# EAGLE schematic main (EAGLE 7.1.0)
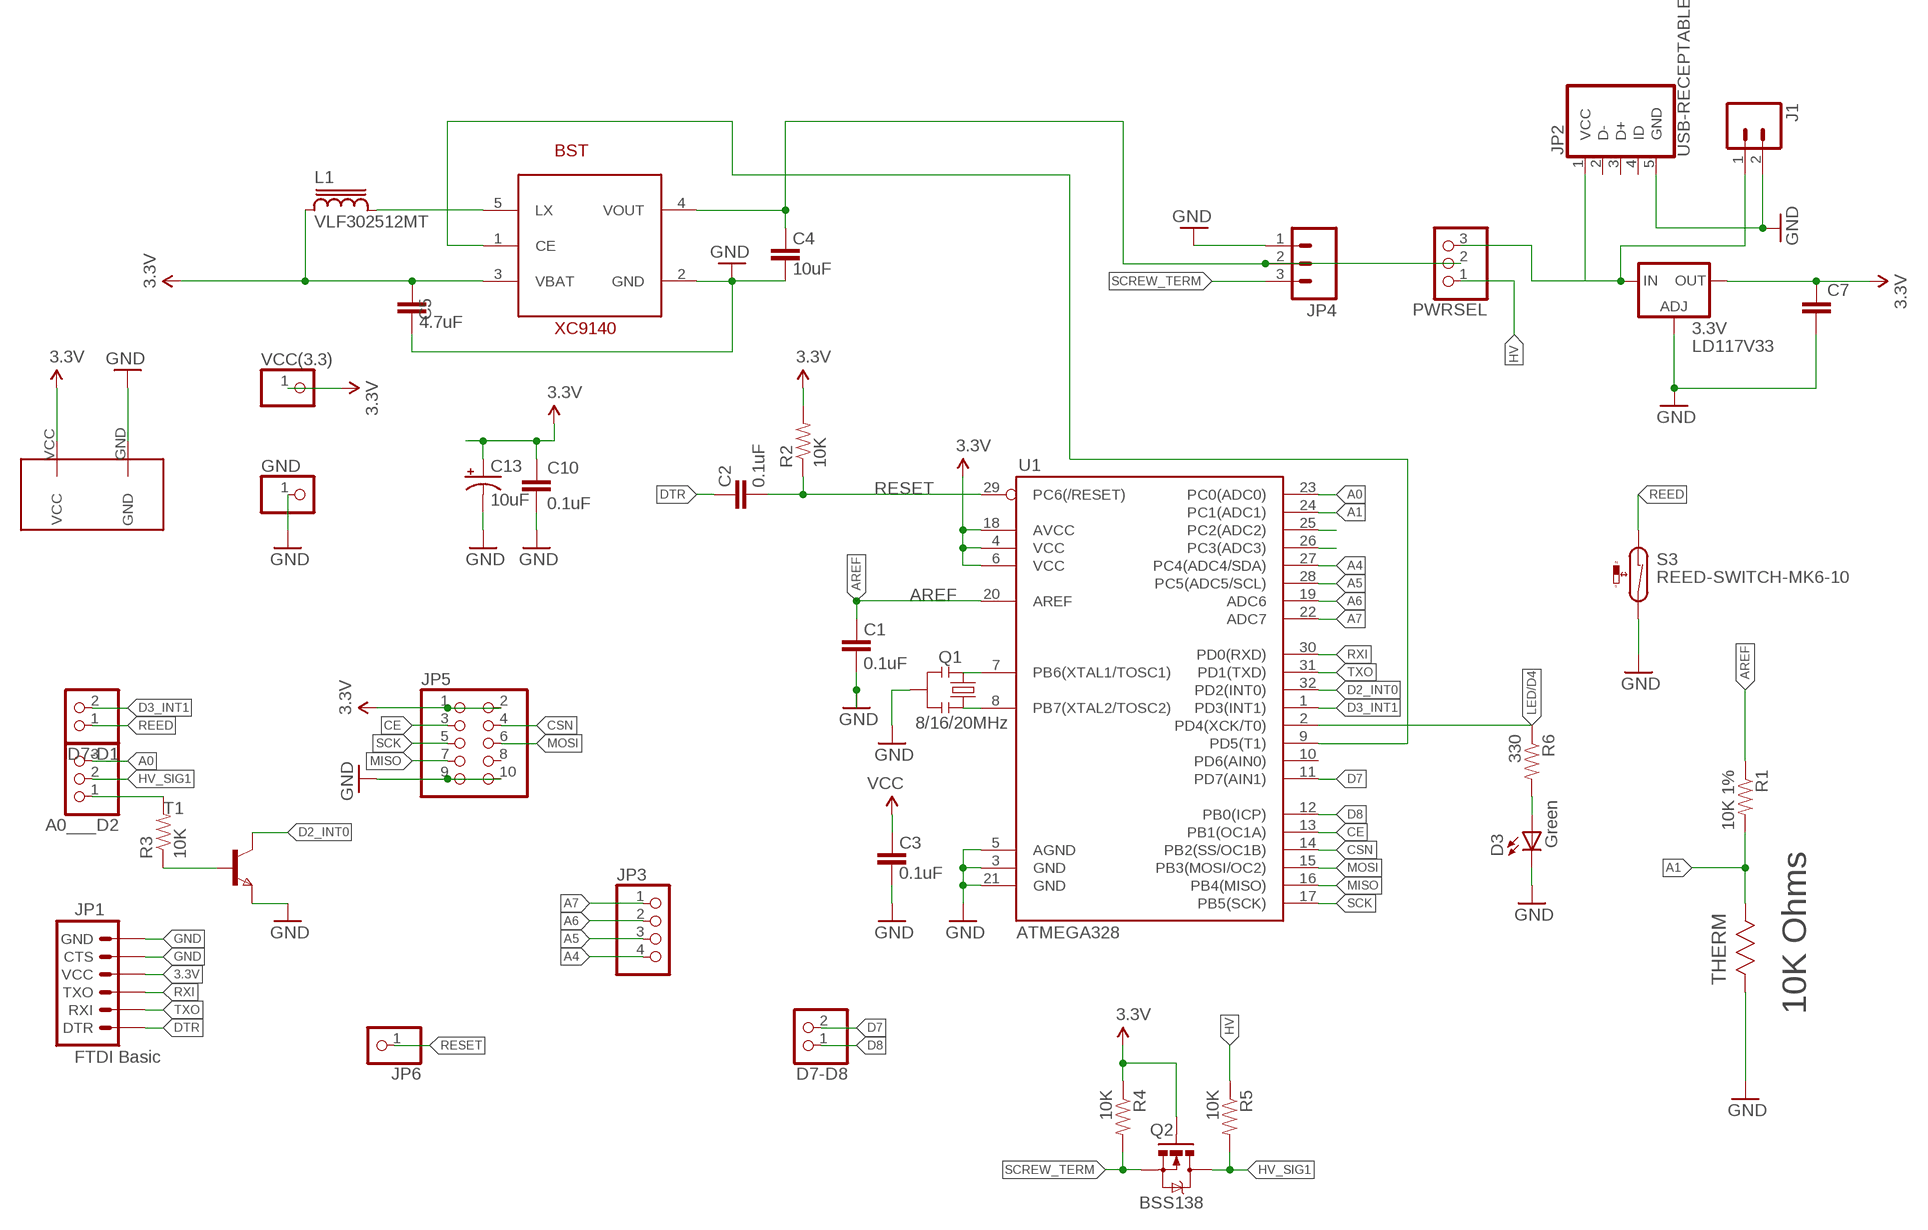
[diagram p0: schematic, sheet 1]

## Parts
3.3V  LD117V33  LD117AV  [TO220L1]
A0___D2  PINHD-1X3  [1X03]
BST  XC9140  [SOT23-5]
C1  0.1uF  CAP0603-CAP  [0603-CAP]
C2  0.1uF  CAP0603-CAP  [0603-CAP]
C3  0.1uF  CAP0603-CAP  [0603-CAP]
C4  10uF  CAP0603-CAP  [0603-CAP]
C5  4.7uF  CAP0603-CAP  [0603-CAP]
C7  C2.5/2  [C2.5-2]
C10  0.1uF  CAP0603-CAP  [0603-CAP]
C13  10uF  CAP_POL1206  [EIA3216]
D3  Green  LED  [0603-LED-ALT1]
D7-D1  PINHD-1X2  [1X02]
D7-D8  PINHD-1X2  [1X02]
GND  PINHD-1X1  [1X01]
J1  M023.5MM  [SCREWTERMINAL-3.5MM-2]
JP1  FTDI Basic  ARDUINO_SERIAL_PROGRAMPTH  [1X06]
JP2  USB-RECEPTABLE  [FCI-10103594-0001LF]
JP3  PINHD-1X4  [1X04]
JP4  M03SCREW  [SCREWTERMINAL-3.5MM-3]
JP5  PINHD-2X5  [2X05]
JP6  PINHD-1X1  [1X01]
L1  VLF302512MT  [VLF302512MT]
PWRSEL  PINHD-1X3  [1X03]
Q1  8/16/20MHz  RESONATOR1:1  [RESONATOR-SMD-1:1]
Q2  BSS138  MOSFET-NCHANNELSMD  [SOT23-3]
R1  10K 1%  RESISTOR0603-RES  [0603-RES]
R2  10K  RESISTOR0603-RES  [0603-RES]
R3  10K  RESISTOR0603-RES  [0603-RES]
R4  10K  RESISTOR0603-RES  [0603-RES]
R5  10K  RESISTOR0603-RES  [0603-RES]
R6  330  RESISTOR0603-RES  [0603-RES]
S3  REED-SWITCH-MK6-10  [MK6-10]
T1  NPNSOT323  [SOT323]
THERM  10K Ohms  NTCS0603E3103HMT  [RESC1608X95N]
U1  ATMEGA328  ATMEGA168  [TQFP32-08]
U$1  BAT  [AAABATTERY]
VCC(3.3)  PINHD-1X1  [1X01]

## Nets
3.3V [vcc]: 3.3V.2(OUT) BST.3(VBAT) C3.2 C5.2 C7.1 C10.1 C13.A(+) JP1.4(VCC) JP5.1 JP5.2 L1.1 Q2.1(G) R2.2 R4.1 U1.4(VCC) U1.6(VCC) U1.18(AVCC) U$1.VCC VCC(3.3).1 ; supply symbol labelled VCC
A0: A0___D2.3 U1.23(PC0(ADC0))
A1: R1.2 THERM.1 U1.24(PC1(ADC1))
A2: U1.25(PC2(ADC2))
A3: U1.26(PC3(ADC3))
A4: JP3.4 U1.27(PC4(ADC4/SDA))
A5: JP3.3 U1.28(PC5(ADC5/SCL))
A6: JP3.2 U1.19(ADC6)
A7: JP3.1 U1.22(ADC7)
AREF: C1.2 R1.1 U1.20(AREF)
BOOST_VCC [vcc]: BST.4(VOUT) C4.2 JP4.2 PWRSEL.2
CE: JP5.3 U1.13(PB1(OC1A))
CSN: JP5.4 U1.14(PB2(SS/OC1B))
D2_INT0: T1.1(C) U1.32(PD2(INT0))
D2_VIA_FET: A0___D2.1 R3.2
D3_INT1: D7-D1.2 U1.1(PD3(INT1))
D5: BST.1(CE) U1.9(PD5(T1))
D7: D7-D8.2 U1.11(PD7(AIN1))
D8: D7-D8.1 U1.12(PB0(ICP))
DTR [vcc]: C2.2 JP1.1(DTR)
GND [vcc]: 3.3V.1(ADJ) BST.2(GND) C1.1 C3.1 C4.1 C5.1 C7.2 C10.2 C13.C(-) D3.C GND.1 J1.2 JP1.5(CTS) JP1.6(GND) JP2.5(GND) JP4.1 JP5.9 JP5.10 Q1.2 S3.2 T1.3(E) THERM.2 U1.3(GND) U1.5(AGND) U1.21(GND) U$1.GND
HV [vcc]: PWRSEL.1 R5.1
HV_SIG1: A0___D2.2 Q2.3(D) R5.2
LED/D4: R6.1 U1.2(PD4(XCK/T0))
MISO: JP5.7 U1.16(PB4(MISO))
MOSI: JP5.6 U1.15(PB3(MOSI/OC2))
N$1: Q1.3 U1.8(PB7(XTAL2/TOSC2))
N$2: Q1.1 U1.7(PB6(XTAL1/TOSC1))
N$6: R3.1 T1.2(B)
N$7: D3.A R6.2
N$8: BST.5(LX) L1.2
RAW_PWR [vcc]: 3.3V.3(IN) J1.1 JP2.1(VCC) PWRSEL.3
REED: D7-D1.1 S3.1
RESET: C2.1 JP6.1 R2.1 U1.29(PC6(/RESET))
RXI: JP1.3(TXO) U1.30(PD0(RXD))
SCK: JP5.5 U1.17(PB5(SCK))
SCREW_TERM: JP4.3 Q2.2(S) R4.2
TXO: JP1.2(RXI) U1.31(PD1(TXD))
Unconnected: JP2.2(D-) JP2.3(D+) JP2.4(ID) JP5.8 U1.10(PD6(AIN0))

## Library data of the parts
3.3V = v-reg:LD117A?*: Low drop fixed and adjustable positive voltage regulators 1 A Source: http://www.st.com/stonline/products/literature/ds/7194/ld1117axx.pdf
A0___D2 PWRSEL = pinhead:PINHD-1X3: PIN HEADER
BST = boost:XC9140
C1-C5 C10 = SparkFun:CAP: Capacitor Standard 0603 ceramic capacitor, and 0.1" leaded capacitor.
C7 = capacitor-wima:C: CAPACITOR naming: grid - package width
C13 = SparkFun:CAP_POL: Capacitor Polarized These are standard SMD and PTH capacitors. Normally 10uF, 47uF, and 100uF in electrolytic and tantalum varieties. Always verify the external diameter of the through hole cap, it varies with capacity, voltage, and manufacturer. The EIA devices should be standard.
D3 = Testing:LED: LEDs Standard schematic elements and footprints for 5mm, 3mm, 1206, and 0603 sized LEDs. 5mm - Spark Fun Electronics SKU : COM-00529 (and others)
D7-D1 D7-D8 = pinhead:PINHD-1X2: PIN HEADER
GND JP6 VCC(3.3) = pinhead:PINHD-1X1: PIN HEADER
J1 = SparkFun-Connectors:M02: Standard 2-pin 0.1" header. Use with - straight break away headers ( PRT-00116) - right angle break away headers (PRT-00553) - swiss pins (PRT-00743) - machine pins (PRT-00117) - female headers (PRT-00115) Molex polarized connector foot print use with: PRT-08233 with associated crimp pins and housings. 2.54_SCREWTERM for use with PRT-10571. 3.5mm Screw Terminal footprints for PRT-08084 5mm Screw Terminal footprints for use with PRT-08432; PROD_ID: CONN-08399
JP1 = SparkFun:ARDUINO_SERIAL_PROGRAM
JP2 = daspilker:USB-RECEPTABLE: USB Receptable
JP3 = pinhead:PINHD-1X4: PIN HEADER
JP4 = SparkFun-Connectors:M03: Header 3 Standard 3-pin 0.1" header. Use with straight break away headers (SKU : PRT-00116), right angle break away headers (PRT-00553), swiss pins (PRT-00743), machine pins (PRT-00117), and female headers (PRT-00115). Molex polarized connector foot print use with SKU : PRT-08232 with associated crimp pins and housings.
JP5 = pinhead:PINHD-2X5: PIN HEADER
L1 = inductor-tdk:VLF302512MT
Q1 = Testing:RESONATOR: Resonator Small SMD resonator. This is the itty bitty 10/20MHz resonators with built in caps. CSTCE10M0G55 and CSTCE20M0V53. Footprint for SMD has been used in SFE production for years, and does work okay. 1:1 is an attempt to get larger fillets on the sides so it will be easier to inspect these solders in our AOI machine. The pads have been minimized to match the actual metal under the resonator. To see this relation, it includes an image import of the bottom side of the component. Imported to scale on layer 200.
Q2 = SparkFun:MOSFET-NCHANNEL
R1-R6 = SparkFun:RESISTOR: Resistor Basic schematic elements and footprints for 0603, 1206, and PTH resistors.
S3 = switch-reed:REED-SWITCH-: Reed Sensor; OC_FARNELL: unknown
T1 = zetex:NPNSOT323: NPN TRANSISTOR; MPN: DSS4160U-7; OC_FARNELL: 1710696; OC_NEWARK: 25R4558
THERM = Vishay_By_element14_Batch_1:NTCS0603E3103HMT: RESISTOR, 0603; MPN: NTCS0603E3103HMT; OC_FARNELL: 1874161; OC_NEWARK: 63H2050; SUPPLIER: Vishay; TOLERANCE: ± 3%; WATTAGE: 125 mW
U1 = SparkFun:ATMEGA168
U$1 = battery_wilkie:BAT

## Net classes
0 default: width 0.152 mm
1 vcc: width 0.406 mm
2 GND: width 0.406 mm